# EAGLE design motorControl (EAGLE 7.5.0)

## Sheet 1 of 5: MAIN_MCU
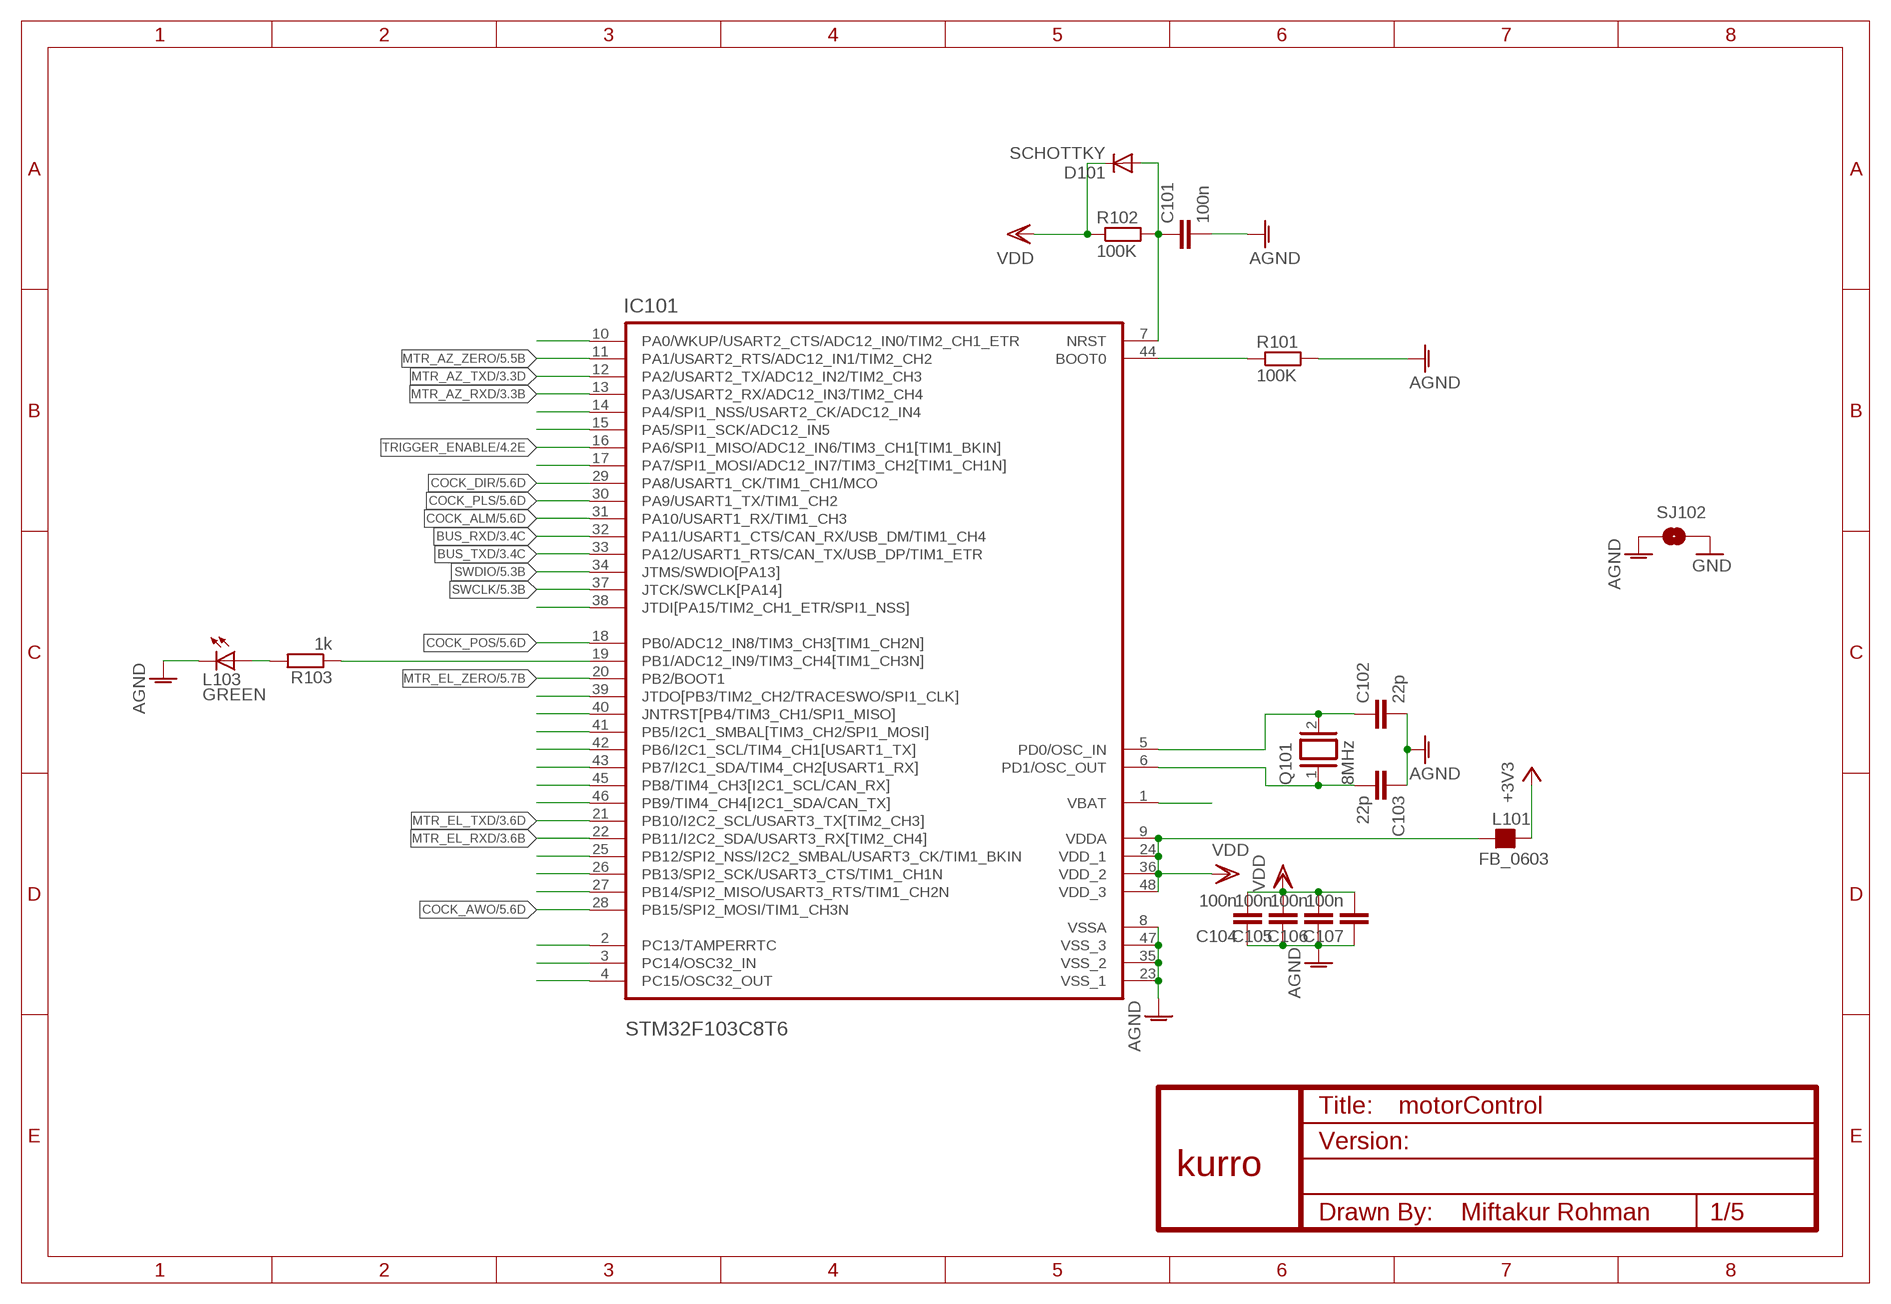
[diagram p0: schematic, sheet 1]

### Parts
C101  100n  C-EUC0603  [C0603]
C102  22p  C-EUC0603  [C0603]
C103  22p  C-EUC0603  [C0603]
C104  100n  C-EUC0603  [C0603]
C105  100n  C-EUC0603  [C0603]
C106  100n  C-EUC0603  [C0603]
C107  100n  C-EUC0603  [C0603]
D101  SCHOTTKY  DIODE-MICROMELF-W  [MICROMELF-W]
IC101  STM32F103C8T6  [QFP50P900X900X160-48N]
L101  FB_0603  [L0603]
L103  GREEN  LEDCHIP-LED0805  [CHIP-LED0805]
Q101  8MHz  XTAL/S  [QS]
R101  100K  R-EU_R0603  [R0603]
R102  100K  R-EU_R0603  [R0603]
R103  1k  R-EU_R0603  [R0603]
SJ102  SOLDERJUMPERTRACE  [SJ_2S-TRACE]
U$1  KURRO_FOOTPRINT  [KURRO-LOGO]

### Nets
+3V3: L101.2 ; also sheet 2,3,4
AGND [ic]: C101.2 C102.2 C103.1 C104.1 C105.1 C106.1 C107.1 IC101.8(VSSA) IC101.23(VSS_1) IC101.35(VSS_2) IC101.47(VSS_3) L103.C R101.2 SJ102.1
BOOT0 [ic]: IC101.44(BOOT0) R101.1
BUS_RXD [ic]: IC101.32(PA11/USART1_CTS/CAN_RX/USB_DM/TIM1_CH4) ; also sheet 3
BUS_TXD [ic]: IC101.33(PA12/USART1_RTS/CAN_TX/USB_DP/TIM1_ETR) ; also sheet 3
COCK_ALM [ic]: IC101.31(PA10/USART1_RX/TIM1_CH3) ; also sheet 5
COCK_AWO [ic]: IC101.28(PB15/SPI2_MOSI/TIM1_CH3N) ; also sheet 5
COCK_DIR [ic]: IC101.29(PA8/USART1_CK/TIM1_CH1/MCO) ; also sheet 5
COCK_PLS [ic]: IC101.30(PA9/USART1_TX/TIM1_CH2) ; also sheet 5
COCK_POS [ic]: IC101.18(PB0/ADC12_IN8/TIM3_CH3[TIM1_CH2N]) ; also sheet 5
GND: SJ102.2 ; also sheet 2,3,4,5
MTR_AZ_RXD [ic]: IC101.13(PA3/USART2_RX/ADC12_IN3/TIM2_CH4) ; also sheet 3
MTR_AZ_TXD [ic]: IC101.12(PA2/USART2_TX/ADC12_IN2/TIM2_CH3) ; also sheet 3
MTR_AZ_ZERO [ic]: IC101.11(PA1/USART2_RTS/ADC12_IN1/TIM2_CH2) ; also sheet 5
MTR_EL_RXD [ic]: IC101.22(PB11/I2C2_SDA/USART3_RX[TIM2_CH4]) ; also sheet 3
MTR_EL_TXD [ic]: IC101.21(PB10/I2C2_SCL/USART3_TX[TIM2_CH3]) ; also sheet 3
MTR_EL_ZERO [ic]: IC101.20(PB2/BOOT1) ; also sheet 5
N$1 [ic]: IC101.25(PB12/SPI2_NSS/I2C2_SMBAL/USART3_CK/TIM1_BKIN)
N$2 [ic]: L103.A R103.2
N$3 [ic]: IC101.26(PB13/SPI2_SCK/USART3_CTS/TIM1_CH1N)
N$4 [ic]: IC101.10(PA0/WKUP/USART2_CTS/ADC12_IN0/TIM2_CH1_ETR)
N$5 [ic]: IC101.19(PB1/ADC12_IN9/TIM3_CH4[TIM1_CH3N]) R103.1
N$6 [ic]: C103.2 IC101.6(PD1/OSC_OUT) Q101.1
N$7 [ic]: C102.1 IC101.5(PD0/OSC_IN) Q101.2
N$11 [ic]: IC101.3(PC14/OSC32_IN)
N$12 [ic]: IC101.2(PC13/TAMPERRTC)
N$14 [ic]: IC101.46(PB9/TIM4_CH4[I2C1_SDA/CAN_TX])
N$15 [ic]: IC101.45(PB8/TIM4_CH3[I2C1_SCL/CAN_RX])
N$16 [ic]: IC101.43(PB7/I2C1_SDA/TIM4_CH2[USART1_RX])
N$17 [ic]: IC101.39(JTDO[PB3/TIM2_CH2/TRACESWO/SPI1_CLK])
N$18 [ic]: IC101.40(JNTRST[PB4/TIM3_CH1/SPI1_MISO])
N$19 [ic]: IC101.42(PB6/I2C1_SCL/TIM4_CH1[USART1_TX])
N$20 [ic]: IC101.38(JTDI[PA15/TIM2_CH1_ETR/SPI1_NSS])
N$21 [ic]: IC101.14(PA4/SPI1_NSS/USART2_CK/ADC12_IN4)
N$23 [ic]: IC101.15(PA5/SPI1_SCK/ADC12_IN5)
N$29 [ic]: IC101.27(PB14/SPI2_MISO/USART3_RTS/TIM1_CH2N)
N$33 [ic]: IC101.17(PA7/SPI1_MOSI/ADC12_IN7/TIM3_CH2[TIM1_CH1N])
N$51 [ic]: IC101.41(PB5/I2C1_SMBAL[TIM3_CH2/SPI1_MOSI])
N$57 [ic]: IC101.4(PC15/OSC32_OUT)
N$58 [ic]: IC101.1(VBAT)
RST [ic]: C101.1 D101.A IC101.7(NRST) R102.2
SWCLK [ic]: IC101.37(JTCK/SWCLK[PA14]) ; also sheet 5
SWDIO [ic]: IC101.34(JTMS/SWDIO[PA13]) ; also sheet 5
TRIGGER_ENABLE [ic]: IC101.16(PA6/SPI1_MISO/ADC12_IN6/TIM3_CH1[TIM1_BKIN]) ; also sheet 4
VDD [ic]: C104.2 C105.2 C106.2 C107.2 D101.C IC101.9(VDDA) IC101.24(VDD_1) IC101.36(VDD_2) IC101.48(VDD_3) L101.1 R102.1 ; also sheet 5

## Sheet 2 of 5: PSU
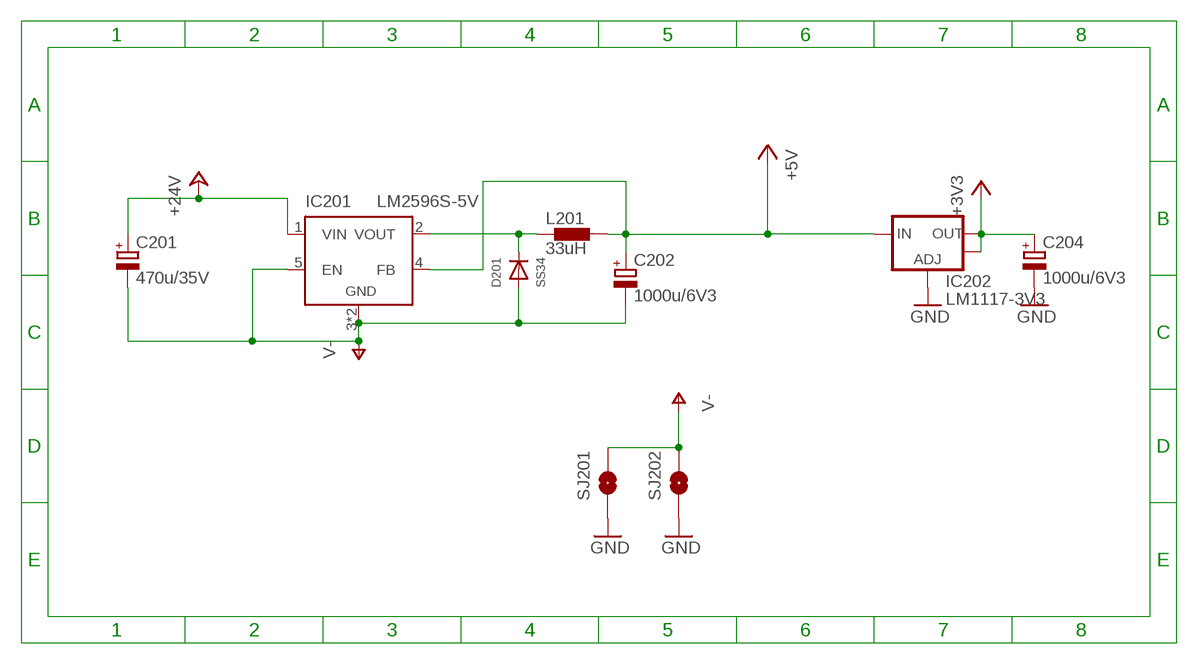
[diagram p1: schematic, sheet 2]

### Parts
C201  470u/35V  CPOL-EU153CLV-1012  [153CLV-1012]
C202  1000u/6V3  CPOL-EU153CLV-0810  [153CLV-0810]
C204  1000u/6V3  CPOL-EU153CLV-0810  [153CLV-0810]
D201  SS34  DIODESMA  [SMADIODE]
IC201  LM2596S-5V  LM2596S-ADJ  [D2PAK]
IC202  LM1117-3V3  V_REG_LM1117SOT223  [SOT223]
L201  33uH  PA4342  [PA4342]
SJ201  SOLDERJUMPERTRACE  [SJ_2S-TRACE]
SJ202  SOLDERJUMPERTRACE  [SJ_2S-TRACE]

### Nets
+3V3: C204.+ IC202.2(OUT) IC202.4(OUT) ; also sheet 1,3,4
+5V: C202.+ IC201.4(FB) IC202.3(IN) L201.P$2 ; also sheet 3,5
+24V [power]: C201.+ IC201.1(VIN) ; also sheet 4,5
GND: C204.- IC202.1(ADJ) SJ201.1 SJ202.1 ; also sheet 1,3,4,5
LM2596_OUT [power]: D201.C IC201.2(VOUT) L201.P$1
V- [power]: C201.- C202.- D201.A IC201.3(GND) IC201.5(EN) IC201.6(GND) SJ201.2 SJ202.2 ; also sheet 4,5

## Sheet 3 of 5: COMM
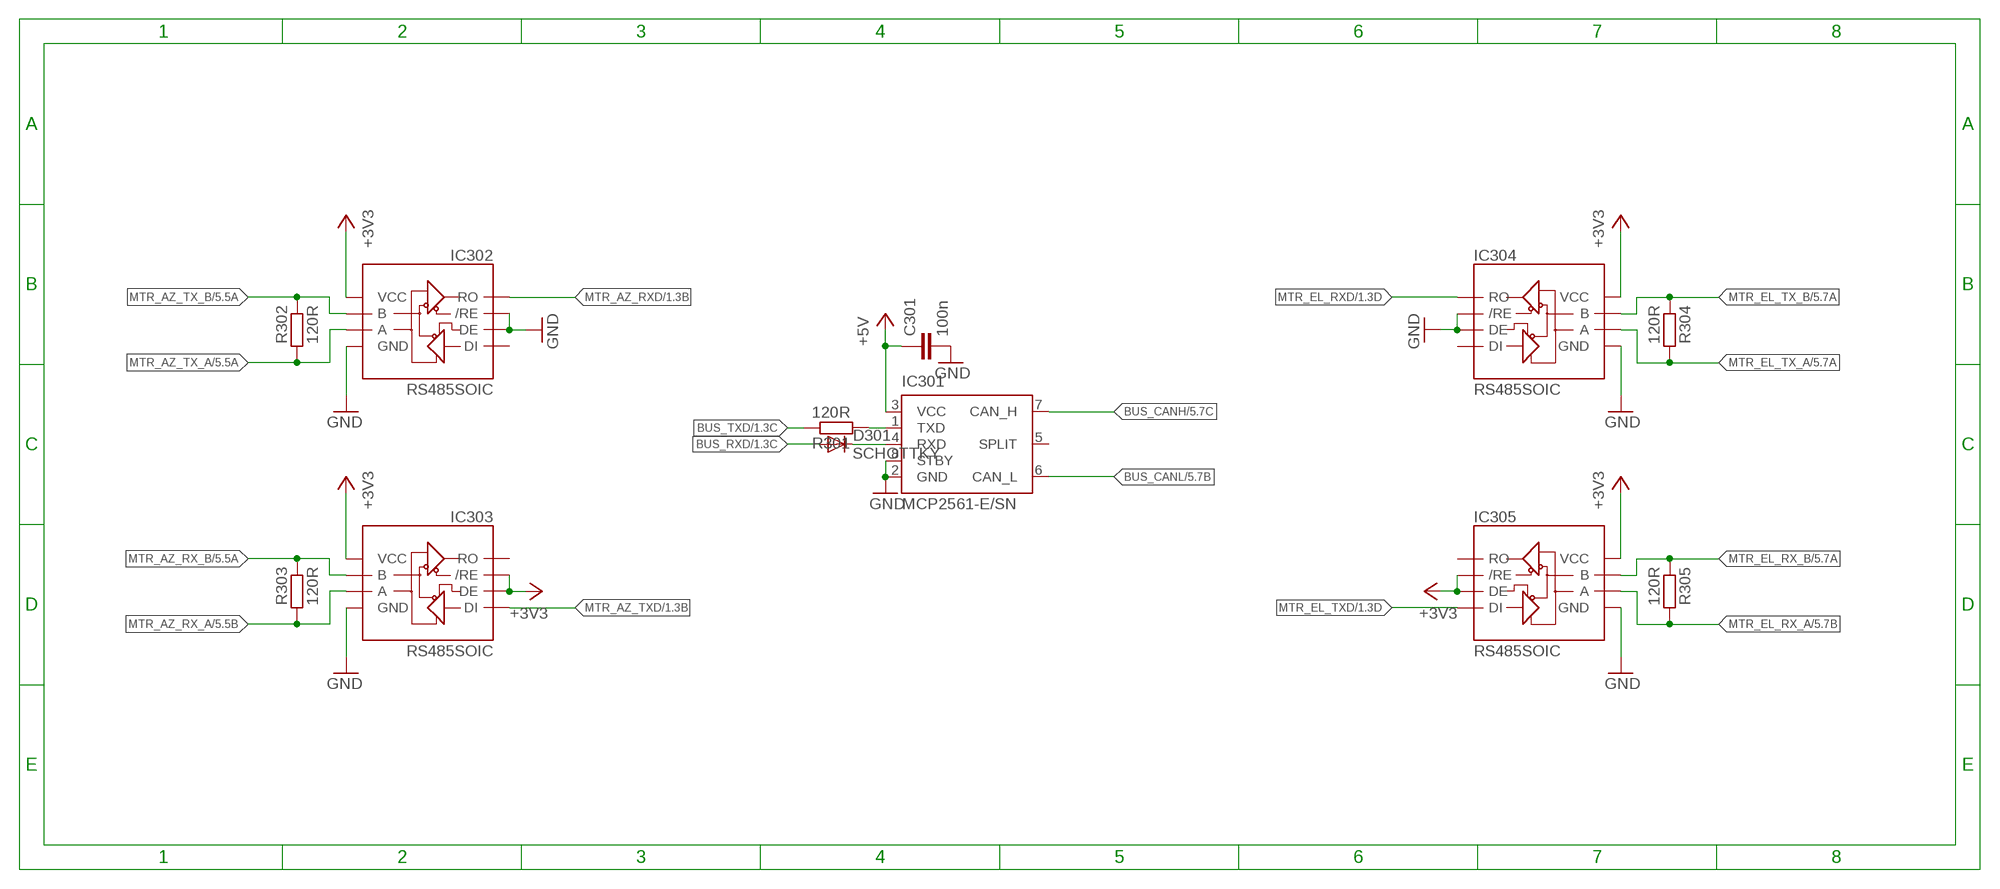
[diagram p2: schematic, sheet 3]

### Parts
C301  100n  C-EUC0603  [C0603]
D301  SCHOTTKY  DIODE-MICROMELF-W  [MICROMELF-W]
IC301  MCP2561-E/SN  [SOIC-8]
IC302  RS485SOIC  [SO08]
IC303  RS485SOIC  [SO08]
IC304  RS485SOIC  [SO08]
IC305  RS485SOIC  [SO08]
R301  120R  R-EU_R0603  [R0603]
R302  120R  R-EU_R0603  [R0603]
R303  120R  R-EU_R0603  [R0603]
R304  120R  R-EU_R0603  [R0603]
R305  120R  R-EU_R0603  [R0603]

### Nets
+3V3: IC302.8(VCC) IC303.2(/RE) IC303.3(DE) IC303.8(VCC) IC304.8(VCC) IC305.2(/RE) IC305.3(DE) IC305.8(VCC) ; also sheet 1,2,4
+5V: C301.1 IC301.3(VCC) ; also sheet 2,5
BUS_CANH: IC301.7(CAN_H) ; also sheet 5
BUS_CANL: IC301.6(CAN_L) ; also sheet 5
BUS_RXD [ic]: D301.A ; also sheet 1
BUS_TXD [ic]: R301.1 ; also sheet 1
GND: C301.2 IC301.2(GND) IC301.8(STBY) IC302.2(/RE) IC302.3(DE) IC302.5(GND) IC303.5(GND) IC304.2(/RE) IC304.3(DE) IC304.5(GND) IC305.5(GND) ; also sheet 1,2,4,5
MTR_AZ_RX_A: IC303.6(A) R303.2 ; also sheet 5
MTR_AZ_RX_B: IC303.7(B) R303.1 ; also sheet 5
MTR_AZ_RXD [ic]: IC302.1(RO) ; also sheet 1
MTR_AZ_TX_A: IC302.6(A) R302.2 ; also sheet 5
MTR_AZ_TX_B: IC302.7(B) R302.1 ; also sheet 5
MTR_AZ_TXD [ic]: IC303.4(DI) ; also sheet 1
MTR_EL_RX_A: IC305.6(A) R305.2 ; also sheet 5
MTR_EL_RX_B: IC305.7(B) R305.1 ; also sheet 5
MTR_EL_RXD [ic]: IC304.1(RO) ; also sheet 1
MTR_EL_TX_A: IC304.6(A) R304.2 ; also sheet 5
MTR_EL_TX_B: IC304.7(B) R304.1 ; also sheet 5
MTR_EL_TXD [ic]: IC305.4(DI) ; also sheet 1
N$9: IC301.1(TXD) R301.2
N$10: D301.C IC301.4(RXD)
Unconnected: IC301.5(SPLIT) IC302.4(DI) IC303.1(RO) IC304.4(DI) IC305.1(RO)

## Sheet 4 of 5: TRIGGER
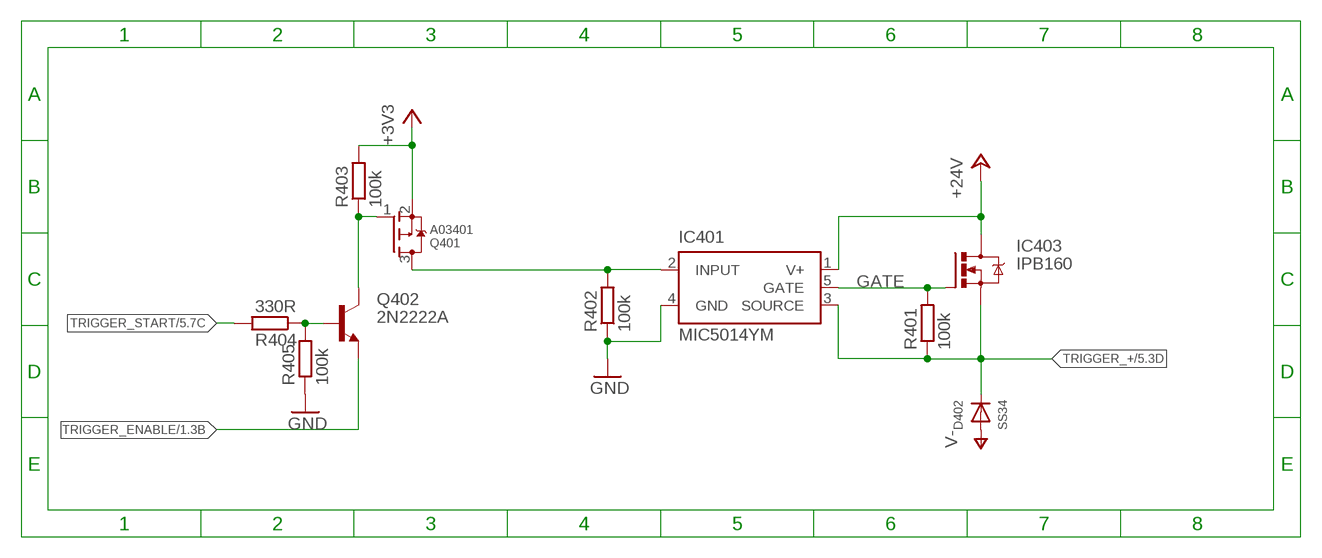
[diagram p3: schematic, sheet 4]

### Parts
D402  SS34  DIODESMA  [SMADIODE]
IC401  MIC5014YM  [SO-08]
IC403  IPB160  [PG-TO263-7]
Q401  A03401  A03401-REFLOW  [SOT23]
Q402  2N2222A  2N2222A-REFLOW  [SOT23]
R401  100k  R-EU_R0603  [R0603]
R402  100k  R-EU_R0603  [R0603]
R403  100k  R-EU_R0603  [R0603]
R404  330R  R-EU_R0603  [R0603]
R405  100k  R-EU_R0603  [R0603]

### Nets
+3V3: Q401.2(S) R403.2 ; also sheet 1,2,3
+24V [power]: IC401.1(V+) IC403.4(D) ; also sheet 2,5
GATE: IC401.5(GATE) IC403.1(G) R401.2
GND: IC401.4(GND) R402.1 R405.1 ; also sheet 1,2,3,5
N$8 [ic]: Q401.1(G) Q402.3(C) R403.1
N$32 [ic]: Q402.1(B) R404.1 R405.2
TRIGGER_+ [power]: D402.C IC401.3(SOURCE) IC403.2(S) IC403.3(S) IC403.5(S) IC403.6(S) IC403.7(S) R401.1 ; also sheet 5
TRIGGER_ENABLE [ic]: Q402.2(E) ; also sheet 1
TRIGGER_INPUT: IC401.2(INPUT) Q401.3(D) R402.2
TRIGGER_START: R404.2 ; also sheet 5
V- [power]: D402.A ; also sheet 2,5

## Sheet 5 of 5: CONNECTOR
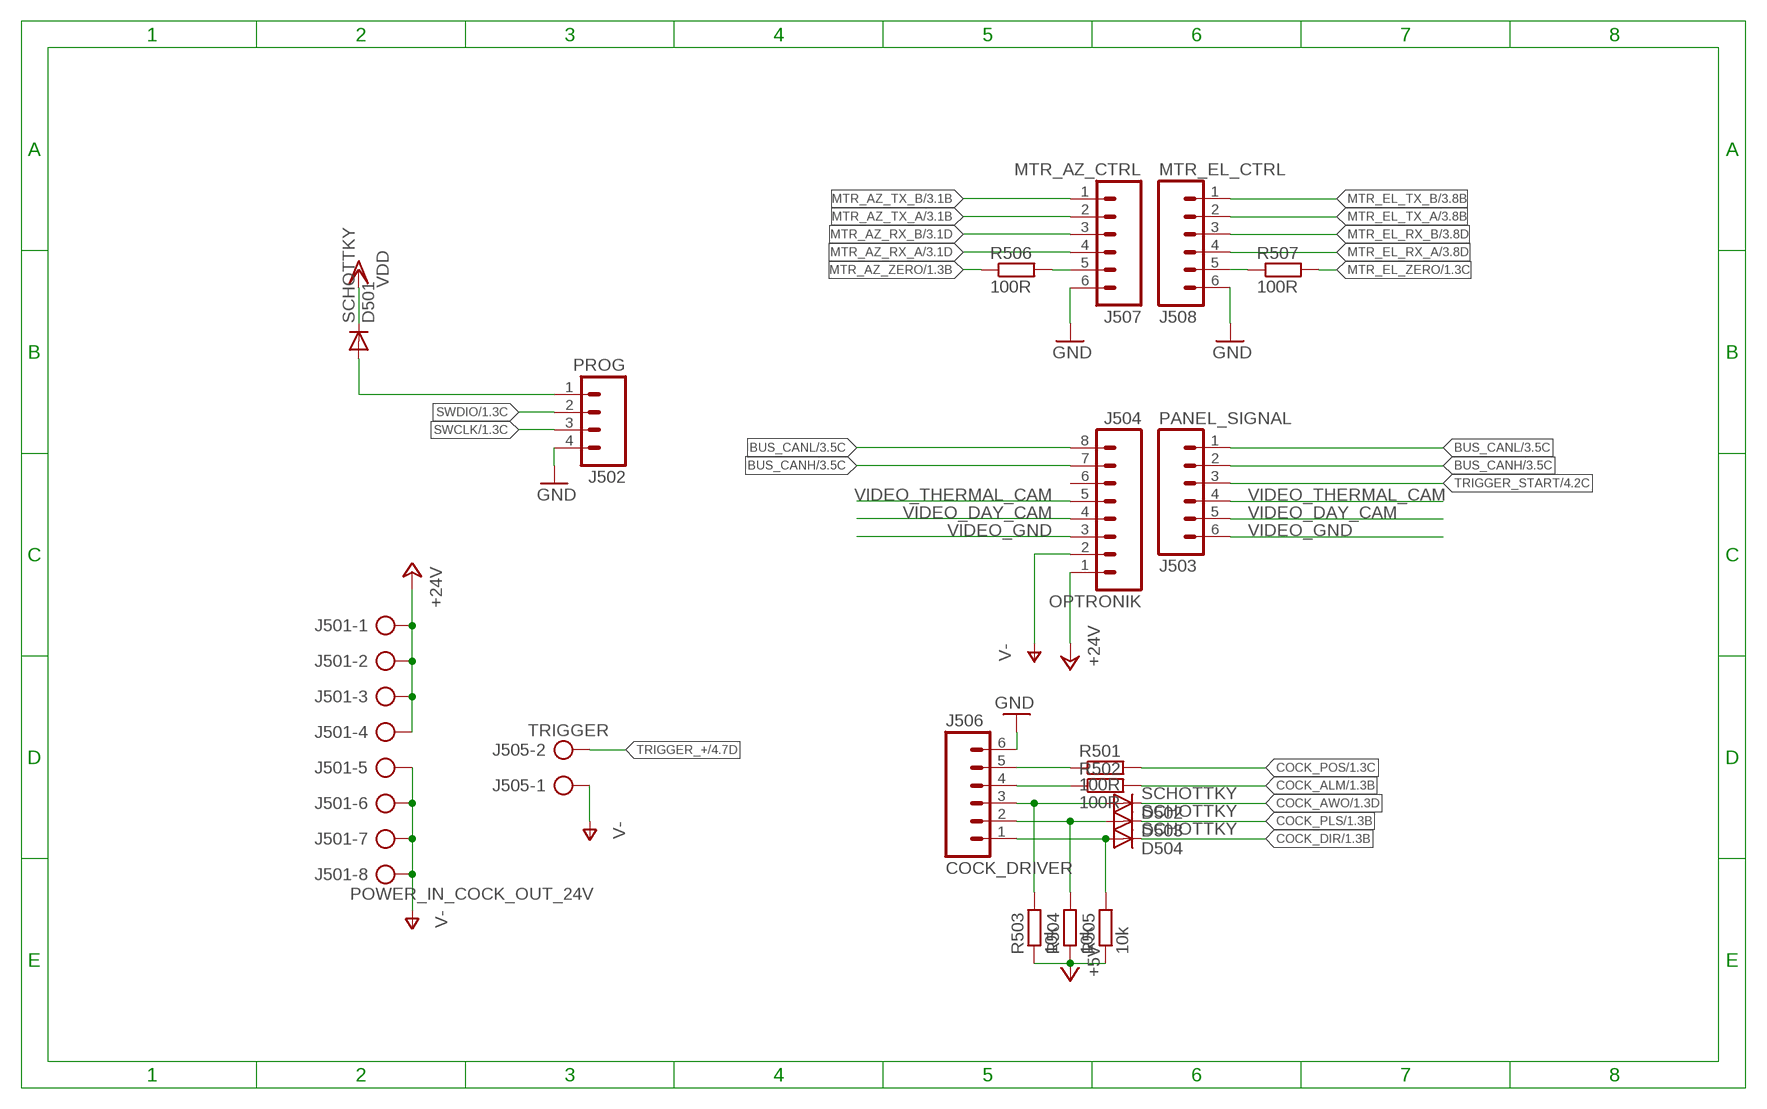
[diagram p4: schematic, sheet 5]

### Parts
D501  SCHOTTKY  DIODE-MICROMELF-W  [MICROMELF-W]
D502  SCHOTTKY  DIODE-MICROMELF-W  [MICROMELF-W]
D503  SCHOTTKY  DIODE-MICROMELF-W  [MICROMELF-W]
D504  SCHOTTKY  DIODE-MICROMELF-W  [MICROMELF-W]
J501  POWER_IN_COCK_OUT_24V  AK300/8  [AK300/8]
J502  PROG  M04-XH-VERT-SMD  [XH-4-VERT-SMD]
J503  PANEL_SIGNAL  M06-XH-VERT-SMD  [XH-6-VERT-SMD]
J504  OPTRONIK  M08-XH-VERT-SMD  [XH-8-VERT-SMD]
J505  TRIGGER  AK300/2  [AK300/2]
J506  COCK_DRIVER  M06-XH-VERT-SMD  [XH-6-VERT-SMD]
J507  MTR_AZ_CTRL  M06-XH-VERT-SMD  [XH-6-VERT-SMD]
J508  MTR_EL_CTRL  M06-XH-VERT-SMD  [XH-6-VERT-SMD]
R501  100R  R-EU_R0603  [R0603]
R502  100R  R-EU_R0603  [R0603]
R503  10k  R-EU_R0603  [R0603]
R504  10k  R-EU_R0603  [R0603]
R505  10k  R-EU_R0603  [R0603]
R506  100R  R-EU_R0603  [R0603]
R507  100R  R-EU_R0603  [R0603]

### Nets
+5V: R503.1 R504.1 R505.1 ; also sheet 2,3
+24V [power]: J501.1 J501.2 J501.3 J501.4 J504.1 ; also sheet 2,4
BUS_CANH: J503.2 J504.7 ; also sheet 3
BUS_CANL: J503.1 J504.8 ; also sheet 3
COCK_ALM [ic]: R502.2 ; also sheet 1
COCK_AWO [ic]: D502.C ; also sheet 1
COCK_DIR [ic]: D504.C ; also sheet 1
COCK_PLS [ic]: D503.C ; also sheet 1
COCK_POS [ic]: R501.2 ; also sheet 1
GND: J502.4 J506.6 J507.6 J508.6 ; also sheet 1,2,3,4
MTR_AZ_RX_A: J507.4 ; also sheet 3
MTR_AZ_RX_B: J507.3 ; also sheet 3
MTR_AZ_TX_A: J507.2 ; also sheet 3
MTR_AZ_TX_B: J507.1 ; also sheet 3
MTR_AZ_ZERO [ic]: R506.1 ; also sheet 1
MTR_EL_RX_A: J508.4 ; also sheet 3
MTR_EL_RX_B: J508.3 ; also sheet 3
MTR_EL_TX_A: J508.2 ; also sheet 3
MTR_EL_TX_B: J508.1 ; also sheet 3
MTR_EL_ZERO [ic]: R507.2 ; also sheet 1
N$13: J506.5 R501.1
N$25: D504.A J506.1 R505.2
N$26: D503.A J506.2 R504.2
N$27: D501.A J502.1
N$28: D502.A J506.3 R503.2
N$34: J508.5 R507.1
N$35: J506.4 R502.1
N$36: J507.5 R506.2
SWCLK [ic]: J502.3 ; also sheet 1
SWDIO [ic]: J502.2 ; also sheet 1
TRIGGER_+ [power]: J505.2 ; also sheet 4
TRIGGER_START: J503.3 ; also sheet 4
V- [power]: J501.5 J501.6 J501.7 J501.8 J504.2 J505.1 ; also sheet 2,4
VDD [ic]: D501.C ; also sheet 1
VIDEO_DAY_CAM: J503.5 J504.4
VIDEO_GND: J503.6 J504.3
VIDEO_THERMAL_CAM: J503.4 J504.5
Unconnected: J504.6

## Library data of the parts
C101-C107 = resistor:C-EU: CAPACITOR, European symbol
C201 C202 C204 = resistor:CPOL-EU: POLARIZED CAPACITOR, European symbol
C301 = rcl:C-EU: CAPACITOR, European symbol
D101 D301 D501-D504 = diode:DIODE-: DIODE
D201 D402 = adafruit:DIODE: Diode SMADIODE - SMA Surface Mount Package 20V 1A Schottky Diode Digikey: 641-1014-6-ND DO-1N4148 - Through Hole Small Current Diode SOD-123 20V 1 A (.5mV Vf) Schottky Diode - Digikey: MBRX120TPMSCT-ND SOD-323 10V 570mA (.38mV Vf, 3ns) Schottky Diode - Digikey: ZLLS410CT-ND SOD-523 30V 30mA Schottky Diode (RB751S-40TE61) - Digikey: RB751S-40TE61CT-ND SOT23-R/W - SOT23 Package (R = Solder Paste/Reflow Ovens, W = Hand-Soldering) BAT54Film 40V 300mA - Digikey: 497-7162-1-ND
IC101 = ST Microelctronics_By_element14_Batch_1:STM32F103C8T6: Medium-density performance line ARM-based 32-bit MCU; LINK: https://www.tokopedia.com/embedded-world/stm32-stm32f103c8t6-lqfp48-arm-based-microcontroller-mcu-lqfp-48-au02; MPN: STM32F103CBT6; OC_FARNELL: 1606327; OC_NEWARK: 11N8296; PACKAGE: QFP-48; SUPPLIER: STMICROELECTRONICS
IC201 = ON Semiconductor_By_element14_Batch_1:LM2596S: STEP-DOWN VOLTAGE REGULATOR
IC202 = SparkFun:V_REG_LM1117: Voltage Regulator LM1117 Standard adjustable voltage regulator but in SMD form. Spark Fun Electronics SKU : COM-00595
IC301 = microchip:MCP256*
IC302-IC305 = SparkFun-DigitalIC:RS485: RS485 transceiver
IC401 = microchip:MIC501*
IC403 = infineon:IPB160: IPB160 TO-263-7
J501 = con-ptr500:AK300/8: CONNECTOR; OC_FARNELL: unknown; OC_NEWARK: unknown
J502 = SparkFun-Connectors:M04: Header 4 Standard 4-pin 0.1" header. Use with straight break away headers (SKU : PRT-00116), right angle break away headers (PRT-00553), swiss pins (PRT-00743), machine pins (PRT-00117), and female headers (PRT-00115). Molex polarized connector foot print use with SKU : PRT-08231 with associated crimp pins and housings. 1MM SMD Version SKU: PRT-10208
J503 J506-J508 = SparkFun-Connectors:M06: Header 6 Standard 6-pin 0.1" header. Use with straight break away headers (SKU : PRT-00116), right angle break away headers (PRT-00553), swiss pins (PRT-00743), machine pins (PRT-00117), and female headers (PRT-00115). Molex polarized connector foot print use with SKU : PRT-08094 with associated crimp pins and housings. NOTES ON THE VARIANTS LOCK and LOCK_LONGPADS... This footprint was designed to help hold the alignment of a through-hole component (i.e. 6-pin header) while soldering it into place. You may notice that each hole has been shifted either up or down by 0.005 of an inch from it's more standard position (which is a perfectly straight line). This slight alteration caused the pins (the squares in the middle) to touch the edges of the holes. Because they are alternating, it causes a "brace" to hold the component in place. 0.005 has proven to be the perfect amount of "off-center" position when using our standard breakaway headers. Although looks a little odd when you look at the bare footprint, once you have a header in there, the alteration is very hard to notice. Also,if you push a header all the way into place, it is covered up entirely on the bottom side. This idea of altering the position of holes to aid alignment will be further integrated into the Sparkfun Library for other footprints. It can help hold any component with 3 or more connection pins.
J504 = SparkFun-Connectors:M08: Header 8 Standard 8-pin 0.1" header. Use with straight break away headers (SKU : PRT-00116), right angle break away headers (PRT-00553), swiss pins (PRT-00743), machine pins (PRT-00117), and female headers (PRT-00115).
J505 = con-ptr500:AK300/2: CONNECTOR; OC_FARNELL: unknown; OC_NEWARK: unknown
L101 = rc-master:FB_: FERRITE BEAD
L103 = led:LED: LED OSRAM: - CHIPLED LG R971, LG N971, LY N971, LG Q971, LY Q971, LO R971, LY R971 LH N974, LH R974 LS Q976, LO Q976, LY Q976 LO Q996 - Hyper CHIPLED LW Q18S LB Q993, LB Q99A, LB R99A - SideLED LS A670, LO A670, LY A670, LG A670, LP A670 LB A673, LV A673, LT A673, LW A673 LH A674 LY A675 LS A676, LA A676, LO A676, LY A676, LW A676 LS A679, LY A679, LG A679 - Hyper Micro SIDELED® LS Y876, LA Y876, LO Y876, LY Y876 LT Y87S - SmartLED LW L88C, LW L88S LB L89C, LB L89S, LG L890 LS L89K, LO L89K, LY L89K LS L896, LA L896, LO L896, LY L896 - TOPLED LS T670, LO T670, LY T670, LG T670, LP T670 LSG T670, LSP T670, LSY T670, LOP T670, LYG T670 LG T671, LOG T671, LSG T671 LB T673, LV T673, LT T673, LW T673 LH T674 LS T676, LA T676, LO T676, LY T676, LB T676, LH T676, LSB T676, LW T676 LB T67C, LV T67C, LT T67C, LS T67K, LO T67K, LY T67K, LW E67C LS E67B, LA E67B, LO E67B, LY E67B, LB E67C, LV E67C, LT E67C LW T67C LS T679, LY T679, LG T679 LS T770, LO T770, LY T770, LG T770, LP T770 LB T773, LV T773, LT T773, LW T773 LH T774 LS E675, LA E675, LY E675, LS T675 LS T776, LA T776, LO T776, LY T776, LB T776 LHGB T686 LT T68C, LB T68C - Hyper Mini TOPLED® LB M676 - Mini TOPLED Santana® LG M470 LS M47K, LO M47K, LY M47K Source: http://www.osram.convergy.de LUXEON: - LUMILED® LXK2-PW12-R00, LXK2-PW12-S00, LXK2-PW14-U00, LXK2-PW14-V00 LXK2-PM12-R00, LXK2-PM12-S00, LXK2-PM14-U00 LXK2-PE12-Q00, LXK2-PE12-R00, LXK2-PE12-S00, LXK2-PE14-T00, LXK2-PE14-U00 LXK2-PB12-K00, LXK2-PB12-L00, LXK2-PB12-M00, LXK2-PB14-N00, LXK2-PB14-P00, LXK2-PB14-Q00 LXK2-PR12-L00, LXK2-PR12-M00, LXK2-PR14-Q00, LXK2-PR14-R00 LXK2-PD12-Q00, LXK2-PD12-R00, LXK2-PD12-S00 LXK2-PH12-R00, LXK2-PH12-S00 LXK2-PL12-P00, LXK2-PL12-Q00, LXK2-PL12-R00 Source: www.luxeon.com KINGBRIGHT: KA-3528ASYC Source: www.kingbright.com
L201 = scorpion:PA4342
Q101 = special:XTAL/S: CRYSTAL
Q401 = scorpion:A03401*: 30V P-Channel MOSFET Feature: VDS: -30V ID (at VGS=10V): -4A RDS(ON) (at VGS=10V): <50mOhm RDS(ON) (at VGS = 4.5V): <60mOhm RDS(ON) (at VGS = 2.5V): <85mOhm datasheet <http://www.aosmd.com/pdfs/datasheet/AO3401.pdf> tokopedia <https://www.tokopedia.com/tokopuwei/mosfet-ao3401-fet-ao3401-sot23-p-channel-30v-4a-a19t-sot-23-az37>
Q402 = scorpion:2N2222*
R101-R103 R301-R305 R501-R507 = resistor:R-EU_: RESISTOR, European symbol
R401-R405 = rcl:R-EU_: RESISTOR, European symbol
SJ102 = SparkFun:SOLDERJUMPER: Solder Jumper Standard SMD solder jumper. Used to automate production. Two varients : Normally Open and Normally Closed are the same, but have different paste layers. NC will have a large amount of paste and should jumper during reflow.
SJ201 SJ202 = SparkFun:SOLDERJUMPER: Solder Jumper Standard SMD solder jumper. Used to automate production. Two varients : Normally Open and Normally Closed are the same, but have different paste layers. NC will have a large amount of paste and should jumper during reflow.; BOM: EXCLUDE; DNP: T
U$1 = SparkFun:KURRO_FOOTPRINT

## Net classes
0 default: width 0.406 mm, drill 0.59 mm, clearance 0.305 mm
1 ic: width 0.254 mm, drill 0.59 mm, clearance 0.203 mm
2 power: width 0.61 mm, drill 0.79 mm, clearance 0.305 mm

## Board
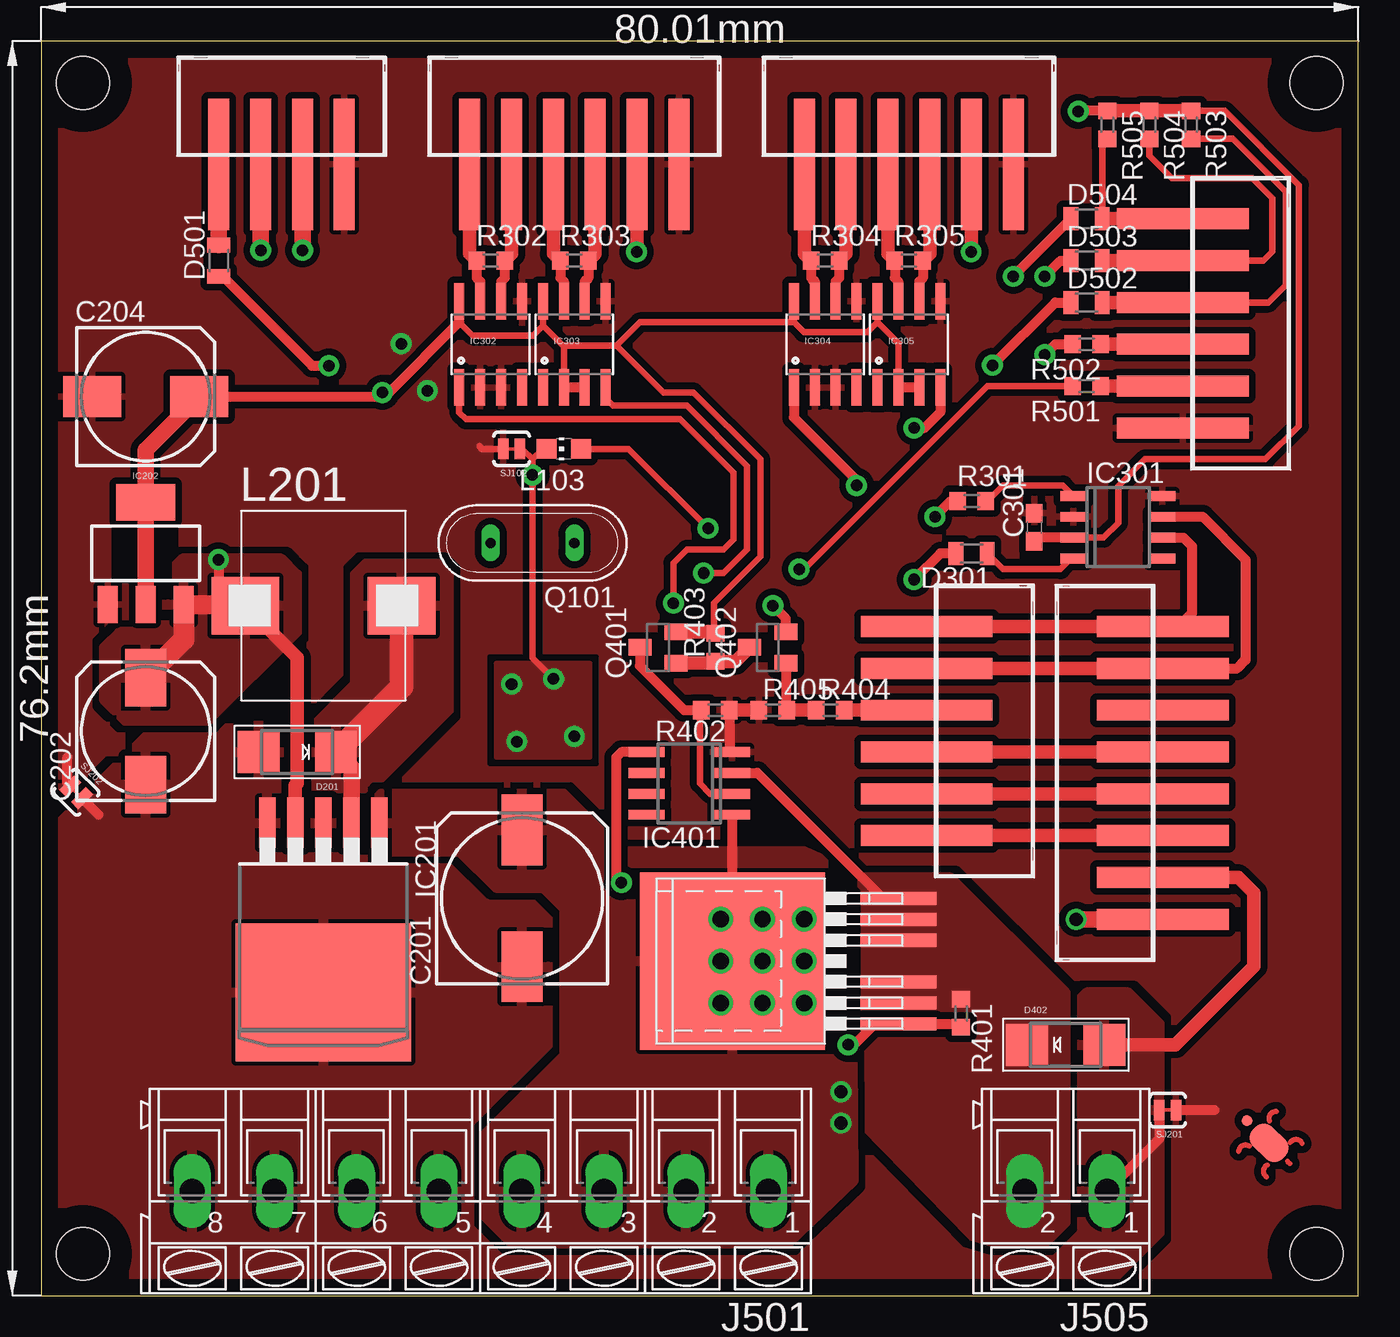
[diagram p5: board, top side]
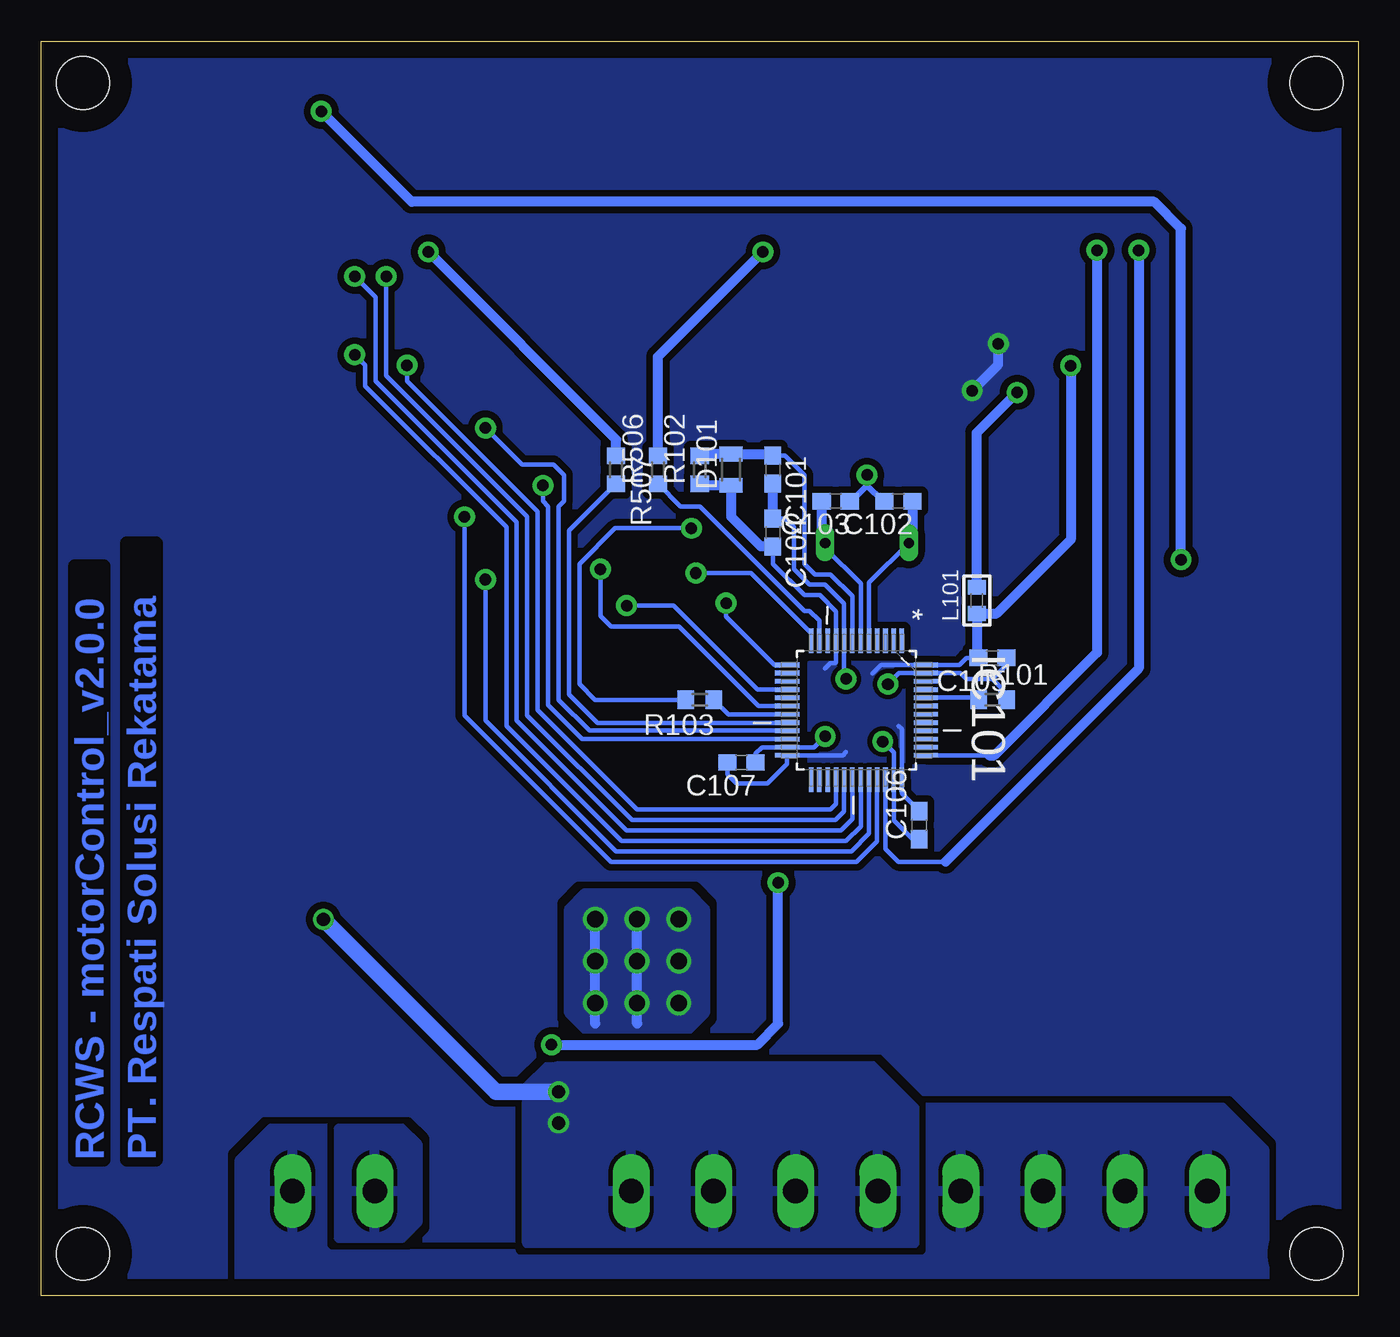
[diagram p6: board, bottom side, seen from below]

Size 80.01 x 76.2 mm. Coordinates in mm from the lower left corner, seen from the top.
Outline: 0,0 80.01,0 80.01,76.2 0,76.2 0,0
Copper layers (1*16): Top 0.035mm / dielectric 1.5mm / Bottom 0.035mm
Design rules "default": minimum track width 10mil, minimum drill 24mil, track to track 8mil, track to pad 8mil, pad to pad 8mil, via to via 8mil, smd to smd 8mil, copper to edge 40mil, drill to drill 8mil, minimum pad ring 10mil, minimum via ring 8mil, stop-mask expansion 4mil, vias tented up to drill 0mil, thermal gap 10mil
Holes 3.2 mm at 2.54,2.54 2.54,73.66 77.47,2.54 77.47,73.66
tRestrict: area 0,0 to 5.1,5.1; area 0,71.1 to 5.1,76.2; area 74.9,0 to 80,5.1; area 74.9,71.1 to 80,76.2; area 47.6,16 to 49.4,24.4; area 4.7,43.7 to 5.3,46.5; area 7.3,43.7 to 7.9,46.7
bRestrict: area 0,0 to 5.1,5.1; area 0,71.1 to 5.1,76.2; area 74.9,0 to 80,5.1; area 74.9,71.1 to 80,76.2

### Footprints (pad centres in the part's own frame; a part is rotated, then mirrored left to right if it is on the bottom)
C0603 = smd 1.1 x 1: 1 -0.85,0; 2 0.85,0
153CLV-1012 = smd 4.3 x 2.5: + 4.15,0; - -4.15,0
153CLV-0810 = smd 3.5 x 2.5: + 3.25,0; - -3.25,0
MICROMELF-W = smd 0.9 x 1.4: A 0.95,0; C -0.95,0
SMADIODE = smd 2.54 x 2.54: A 2.349,0; C -2.349,0
QFP50P900X900X160-48N = smd 1.473 x 0.279: 1 -4.216,2.743; 2 -4.216,2.261; 3 -4.216,1.753; 4 -4.216,1.245; 5 -4.216,0.762; 6 -4.216,0.254; 7 -4.216,-0.254; 8 -4.216,-0.762; 9 -4.216,-1.245; 10 -4.216,-1.753; 11 -4.216,-2.261; 12 -4.216,-2.743; 25 4.216,-2.743; 26 4.216,-2.261; 27 4.216,-1.753; 28 4.216,-1.245; 29 4.216,-0.762; 30 4.216,-0.254; 31 4.216,0.254; 32 4.216,0.762; 33 4.216,1.245; 34 4.216,1.753; 35 4.216,2.261; 36 4.216,2.743 | smd 0.279 x 1.473: 13 -2.743,-4.216; 14 -2.261,-4.216; 15 -1.753,-4.216; 16 -1.245,-4.216; 17 -0.762,-4.216; 18 -0.254,-4.216; 19 0.254,-4.216; 20 0.762,-4.216; 21 1.245,-4.216; 22 1.753,-4.216; 23 2.261,-4.216; 24 2.743,-4.216; 37 2.743,4.216; 38 2.261,4.216; 39 1.753,4.216; 40 1.245,4.216; 41 0.762,4.216; 42 0.254,4.216; 43 -0.254,4.216; 44 -0.762,4.216; 45 -1.245,4.216; 46 -1.753,4.216; 47 -2.261,4.216; 48 -2.743,4.216
D2PAK = smd 3.05 x 1.016: 1 10.305,-3.404; 2 10.305,-1.702; 3 10.305,0; 4 10.305,1.702; 5 10.305,3.404 | smd 8.38 x 10.66: 6 0,0
SOT223 = smd 1.219 x 2.235: 1 -2.311,-3.099; 2 0,-3.099; 3 2.311,-3.099 | smd 3.6 x 2.2: 4 0,3.099
SOIC-8 = smd 0.6 x 1.6: 1 -1.905,-2.7; 2 -0.635,-2.7; 3 0.635,-2.7; 4 1.905,-2.7; 5 1.905,2.7; 6 0.635,2.7; 7 -0.635,2.7; 8 -1.905,2.7
SO08 = smd 0.61 x 2.21: 1 -1.905,-2.616; 2 -0.635,-2.616; 3 0.635,-2.616; 4 1.905,-2.616; 5 1.905,2.616; 6 0.635,2.616; 7 -0.635,2.616; 8 -1.905,2.616
SO-08 = smd 0.6 x 2.2: 1 -1.905,-2.6; 2 -0.635,-2.6; 3 0.635,-2.6; 4 1.905,-2.6; 5 1.905,2.6; 6 0.635,2.6; 7 -0.635,2.6; 8 -1.905,2.6
PG-TO263-7 = smd 0.8 x 4.6: 1 -3.81,-4.45; 2 -2.54,-4.45; 3 -1.27,-4.45; 5 1.27,-4.45; 6 2.54,-4.45; 7 3.81,-4.45 | smd 10.8 x 11.25: 4 0,5.625
AK300/8 = drill 1.5 long: 1 -17.501,0; 2 -12.497,0; 3 -7.518,0; 4 -2.515,0; 5 2.515,0; 6 7.518,0; 7 12.497,0; 8 17.501,0
XH-4-VERT-SMD = smd 1.27 x 8: 1 -3.81,-0.5; 2 -1.27,-0.5; 3 1.27,-0.5; 4 3.81,-0.5
XH-6-VERT-SMD = smd 1.27 x 8: 1 -6.35,-0.5; 2 -3.81,-0.5; 3 -1.27,-0.5; 4 1.27,-0.5; 5 3.81,-0.5; 6 6.35,-0.5
XH-8-VERT-SMD = smd 1.27 x 8: 1 -8.89,-0.5; 2 -6.35,-0.5; 3 -3.81,-0.5; 4 -1.27,-0.5; 5 1.27,-0.5; 6 3.81,-0.5; 7 6.35,-0.5; 8 8.89,-0.5
AK300/2 = drill 1.5 long: 1 -2.515,0; 2 2.489,0
L0603 = smd 0.9 x 1.1: 1 -0.794,0; 2 0.794,0
CHIP-LED0805 = smd 1.2 x 1.2: A 0,-1.05; C 0,1.05
PA4342 = smd 3.5 x 4.1: P$1 0,4.75; P$2 0,-4.75
QS = drill 0.61 long: 1 -2.54,0; 2 2.54,0
SOT23 = smd 1 x 1.4: 1 -0.95,-1.1; 2 0.95,-1.1; 3 0,1.1
R0603 = smd 1 x 1.1: 1 -0.85,0; 2 0.85,0
SJ_2S-TRACE = smd 0.635 x 1.27: 1 -0.508,0; 2 0.508,0
KURRO-LOGO = smd 2.54 x 1.651 rotated 45 bottom: P$1 0,0 | smd 0.635 x 0.635 rotated 45 bottom: P$2 1.347,1.347

### Placement (x,y rotation side)
C101  35.56,50.16 270 bottom
C102  27.94,48.26 180 bottom
C103  31.75,48.26 180 bottom
C104  35.56,46.35 270 bottom
C105  22.23,38.73 180 bottom
C106  26.67,28.57 90 bottom
C107  37.47,32.38 180 bottom
C201  29.21,24.13 90 top
C202  6.35,34.29 90 top
C204  6.35,54.61 0 top
C301  60.33,46.67 90 top
D101  38.1,50.16 90 bottom
D201  15.56,33.02 180 top
D301  56.52,45.09 180 top
D402  62.23,15.24 0 top
D501  10.79,62.87 90 top
D502  63.5,60.33 0 top
D503  63.5,62.87 0 top
D504  63.5,65.41 0 top
IC101  30.48,35.56 270 bottom
IC201  17.14,18.41 90 top
IC202  6.35,45.09 0 top
IC301  65.41,46.67 270 top
IC302  27.3,57.78 0 top
IC303  32.38,57.78 0 top
IC304  47.62,57.78 0 top
IC305  52.7,57.78 0 top
IC401  39.37,31.11 90 top
IC403  47.62,20.32 90 top
J501  26.67,6.35 180 top
J502  14.61,69.22 0 top
J503  54.29,34.29 270 top
J504  67.63,31.75 90 top
J505  62.23,6.35 180 top
J506  69.85,59.05 270 top
J507  32.38,69.22 0 top
J508  52.7,69.22 0 top
L101  23.18,42.23 90 bottom
L103  31.75,51.44 90 top
L201  17.14,41.91 270 top
Q101  29.84,45.72 180 top
Q401  37.47,39.37 90 top
Q402  44.13,39.37 90 top
R101  22.23,36.2 0 bottom
R102  40.01,50.16 90 bottom
R103  40.01,36.2 180 bottom
R301  56.52,48.26 0 top
R302  27.3,62.87 0 top
R303  32.38,62.87 0 top
R304  47.62,62.87 0 top
R305  52.7,62.87 0 top
R401  55.88,17.14 270 top
R402  40.96,35.56 180 top
R403  40.96,39.37 90 top
R404  47.94,35.56 0 top
R405  44.45,35.56 0 top
R501  63.5,55.24 180 top
R502  63.5,57.78 180 top
R503  69.85,71.12 270 top
R504  67.31,71.12 270 top
R505  64.77,71.12 270 top
R506  42.55,50.16 90 bottom
R507  45.09,50.16 270 bottom
SJ102  28.57,51.44 180 top
SJ201  68.42,11.27 180 top
SJ202  2.13,30.57 315 top
U$1  74.59,9.28 0 bottom

### Tracks (layer width: path | path; a pad name or v marks a point on that pad's centre or on a via)
+3V3  (via drill 0.7 pad 1.27)
  Top 0.406: IC302.8 25.4,59.13 26.21,58.32 29.87,58.32 30.48,58.93 | 30.48,58.93 IC303.8 | IC303.2 31.75,57.66 | 31.75,57.66 30.48,58.93 | IC304.8 45.72,59.13 | 45.72,59.13 46.33,58.52 50.19,58.52 50.8,59.13 | 50.8,59.13 IC305.8 | IC305.2 52.07,57.86 50.8,59.13 | 45.72,59.13 36.37,59.13 34.95,57.71 | 34.95,57.71 31.8,57.71 31.75,57.66 | 40.86,40.32 40.86,42.08 43.69,44.91 43.69,50.8 39.62,54.86 37.8,54.86 34.95,57.71
  Top 0.61: IC305.3 IC305.2 | IC303.3 IC303.2 | C204.+ 20.47,54.61 v20.73,54.86 21.13,54.86 25.4,59.13
  Top 0.813: R403.2 40.86,40.32 Q401.2
  Top 1.016: IC202.2 IC202.4 6.35,51.36 C204.+
  Bottom 0.61: L101.2 23.18,52.41 v20.73,54.86
+5V  (via drill 0.7 pad 1.27)
  Top 0.406: IC301.3 64.53,46.04 65.43,46.94 65.43,49.17 67.06,50.8 74.37,50.8 76.4,52.83 76.4,67.46 71.9,71.97 R503.1
  Top 0.61: IC301.3 60.54,46.04 C301.1 | R505.1 63.03,71.97 v62.99,71.93 | v10.77,44.7 10.77,43.53 L201.P$2
  Top 0.813: L201.P$2 15.56,38.75 15.56,31.11 15.44,31 IC201.4 | R505.1 R504.1 R503.1
  Top 1.143: IC202.3 12.32,41.99 L201.P$2
  Top 1.27: IC202.3 8.66,39.85 C202.+
  Bottom 0.61: v10.77,44.7 10.77,64.82 12.39,66.45 57.51,66.45 v62.99,71.93
  pour Top (rank 2): 5.08,34.92 10.16,34.92 15.56,40.32 15.56,43.81 14.61,44.77 8.57,44.77 7.62,43.81 7.62,40.96 6.99,40.32 4.76,40.32 3.81,39.37 3.81,36.2
+24V  (via drill 0.8 pad 1.27, 1 pad 1.27)
  Top 0.61: IC401.1 41.97,20.35 IC403.4 v46.35,20.32 v46.35,17.78 | 39.46,20.32 v43.81,20.32 v43.81,17.78
  Top 1.016: J504.1 v62.87,22.86
  Bottom 0.61: 46.35,16.51 v46.35,17.78 v46.35,20.32 v46.35,22.86 | 43.81,16.51 v43.81,17.78 v43.81,20.32 v43.81,22.86
  Bottom 1.016: v48.58,12.38 52.39,12.38 v62.87,22.86
  other vias: 41.27,22.86 41.27,20.32 41.27,17.78 48.58,10.48
  pour Top (isolate 0.406): 28.57,3.17 45.4,3.17 49.37,6.99 49.21,25.72 46.35,26.99 35.24,26.99 31.75,30.48 20.64,30.48 20.32,30.16 20.32,26.99 25.4,26.99 27.62,24.77 30.48,24.77 31.75,23.5 31.75,14.61 26.99,9.84 26.99,4.76
  pour Bottom (isolate 0.406): 26.99,3.17 50.48,3.17 50.48,12.7 49.21,13.97 29.53,13.97 26.99,11.43
  pour Bottom: 39.69,17.14 40.64,16.19 46.99,16.19 47.94,17.14 47.94,23.5 46.99,24.45 40.64,24.45 39.69,23.5
AGND  (via drill 0.7 pad 1.27)
  Top 0.406: SJ102.1 29.21,51.44 29.84,50.8 | 29.84,50.8 v29.84,49.85 29.84,38.73 v31.11,37.47 | L103.C 30.48,51.44 29.84,50.8
  Bottom 0.279: C106.1 27.09,27.73 28.22,28.85 IC101.35 28.22,32.98 v28.89,33.66 | 22.23,37.47 23.81,37.47 24.17,37.82 IC101.47 27.9,37.82 v28.57,37.15 | 22.23,37.47 21.59,36.83 21.59,36.41 R101.2 | C105.1 21.38,38.31 22.23,37.47 | C107.1 36.62,32.92 36.23,33.3 IC101.23 33.06,33.3 v32.38,33.97 | v31.11,37.47 31.24,37.59 IC101.8 31.24,42.04 32.38,43.18 33.34,43.18 34.29,44.13 34.29,46.67 34.82,47.2 C104.1
  Bottom 0.406: C102.2 28.89,48.26 29.84,49.21 | 29.84,49.21 v29.84,49.85 | C103.1 30.8,48.26 29.84,49.21
  Bottom 0.61: C104.1 C101.2
  pour Top (isolate 0.406, rank 5): 27.62,32.7 33.34,32.7 33.34,38.42 27.62,38.42
BOOT0
  Bottom 0.279: IC101.44 23.2,36.32 R101.1
BUS_CANH
  Top 0.61: IC301.7 70.55,47.31 73.15,44.7 73.15,38.61 72.64,38.1 J504.7
  Top 0.813: J503.2 J504.7
BUS_CANL
  Top 0.61: IC301.6 69.38,46.04 69.9,45.52 69.9,41.45 69.09,40.64 J504.8
  Top 0.813: J503.1 J504.8
BUS_RXD  (via drill 0.7 pad 1.27)
  Top 0.61: D301.A 54.61,45.09 v53.02,43.5
  Bottom 0.279: IC101.32 29.72,28.07 30.8,26.99 45.09,26.99 53.02,34.92 v53.02,43.5
BUS_TXD  (via drill 0.7 pad 1.27)
  Top 0.61: R301.1 55.24,48.26 v54.29,47.31
  Bottom 0.279: IC101.33 29.23,27.6 30.48,26.35 45.4,26.35 54.29,35.24 v54.29,47.31
COCK_ALM  (via drill 0.7 pad 1.27)
  Top 0.61: v60.96,57.15 61.59,57.78 R502.2
  Bottom 0.279: IC101.31 30.23,28.51 31.11,27.62 44.77,27.62 51.75,34.61 51.75,46.67 60.33,55.24 60.33,56.52 v60.96,57.15
COCK_AWO  (via drill 0.7 pad 1.27)
  Top 0.61: v57.78,56.52 61.59,60.33 D502.C
  Bottom 0.279: IC101.28 31.73,29.87 32.07,29.53 43.81,29.53 49.85,35.56 49.85,47.62 57.78,55.56 v57.78,56.52
COCK_DIR  (via drill 0.7 pad 1.27)
  Top 0.61: D504.C v59.06,61.91 v59.05,61.91
  Bottom 0.279: IC101.29 31.24,29.4 31.75,28.89 44.13,28.89 50.48,35.24 50.48,47.31 59.05,55.88 v59.05,61.91
COCK_PLS  (via drill 0.7 pad 1.27)
  Top 0.61: v60.96,61.91 61.91,62.87 D503.C
  Bottom 0.279: IC101.30 30.73,28.96 31.43,28.26 44.45,28.26 51.12,34.92 51.12,46.99 59.69,55.56 59.69,60.64 v60.96,61.91
COCK_POS  (via drill 0.7 pad 1.27)
  Top 0.406: R501.2 57.47,55.24 46.35,44.13 v46.04,44.13
  Bottom 0.279: IC101.18 36.45,35.81 41.27,40.64 45.4,40.64 46.04,41.27 v46.04,44.13
GATE  (via drill 0.7 pad 1.27)
  Top 0.61: R401.2 55.66,16.51 IC403.1 50.65,16.51 49.38,15.24 v49.01,15.24 | IC401.5 35.24,33.02 34.92,32.7 34.92,25.4 v35.24,25.08
  Bottom 0.61: v49.01,15.24 36.51,15.24 35.24,16.51 v35.24,25.08
GND  (via drill 0.7 pad 1.27)
  Top 0.406: SJ102.2 26.8,51.44 26.62,51.61
  Top 0.61: R402.1 41.81,33.18 IC401.4 | SJ201.1 71.28,11.27 | SJ202.1 1.59,31.11 1.59,32.7
  Top 0.813: R405.1 R402.1
  Bottom 0.61: v23.46,54.97 21.87,56.55 v21.87,57.82
  pour Top (isolate 0.406, rank 6): 0,0 80.01,0 80.01,76.2 0,76.2
  pour Bottom (isolate 0.406, rank 6): 0,0 80.01,0 80.01,76.2 0,76.2
LM2596_OUT
  Top 1.016: IC201.2 18.85,32.08 D201.C
  Top 1.422: L201.P$1 21.89,37.01 D201.C
  pour Top (isolate 0.406, rank 2): 16.51,30.8 20,30.8 24.13,34.92 24.77,35.56 24.77,43.81 24.13,44.45 19.68,44.45 19.05,43.81 19.05,37.15 16.51,34.61
MTR_AZ_RX_A
  Top 0.61: R303.2 33.23,61.81 33.02,61.59 IC303.6
  Top 0.813: J507.4 33.66,63.28 R303.2
MTR_AZ_RX_B
  Top 0.61: R303.1 31.54,61.81 31.75,61.59 IC303.7
  Top 0.813: J507.3 31.11,63.28 R303.1
MTR_AZ_RXD  (via drill 0.7 pad 1.27)
  Top 0.406: IC302.1 25.4,53.65 25.81,53.24 38.81,53.24 42.06,49.99 42.06,45.92 41.45,45.31 39.22,45.31 38.41,44.5 v38.41,42.06
  Bottom 0.279: IC101.13 35.46,38.3 38.41,41.25 v38.41,42.06
MTR_AZ_TX_A
  Top 0.61: R302.2 28.16,61.81 27.94,61.59 IC302.6
  Top 0.813: J507.2 28.57,63.28 R302.2
MTR_AZ_TX_B
  Top 0.61: R302.1 26.45,61.81 26.67,61.59 IC302.7
  Top 0.813: J507.1 26.04,63.28 R302.1
MTR_AZ_TXD  (via drill 0.7 pad 1.27)
  Top 0.406: IC303.4 34.29,54.51 34.75,54.05 39.22,54.05 42.88,50.39 42.88,45.31 41.45,43.89 v40.23,43.89
  Bottom 0.279: IC101.12 33.22,40.21 36.91,43.89 v40.23,43.89
MTR_AZ_ZERO
  Bottom 0.279: R506.1 41.17,47.94 40.01,47.94 33.66,41.59 33.34,41.59 32.74,41 IC101.11
MTR_EL_RX_A
  Top 0.61: R305.2 53.55,61.81 53.34,61.59 IC305.6
  Top 0.813: J508.4 53.98,63.28 R305.2
MTR_EL_RX_B
  Top 0.61: R305.1 51.85,61.81 52.07,61.59 IC305.7
  Top 0.813: J508.3 51.44,63.28 R305.1
MTR_EL_RXD  (via drill 0.7 pad 1.27)
  Top 0.61: IC304.1 45.72,53.34 49.53,49.53 v49.53,49.21
  Bottom 0.279: IC101.22 47.14,33.81 49.21,35.88 49.21,47.94 49.53,48.26 v49.53,49.21
MTR_EL_TX_A
  Top 0.61: R304.2 48.48,61.81 48.26,61.59 IC304.6
  Top 0.813: J508.2 48.9,63.28 R304.2
MTR_EL_TX_B
  Top 0.61: R304.1 46.77,61.81 46.99,61.59 IC304.7
  Top 0.813: J508.1 46.35,63.28 R304.1
MTR_EL_TXD  (via drill 0.7 pad 1.27)
  Top 0.61: IC305.4 54.61,53.66 53.66,52.7 v53.02,52.7
  Bottom 0.279: IC101.21 46.7,34.31 48.58,36.2 48.58,47.94 48.26,48.26 48.26,49.85 48.9,50.48 50.8,50.48 v53.02,52.7
MTR_EL_ZERO
  Bottom 0.279: IC101.20 46.23,34.8 47.94,36.51 47.94,46.46 R507.2
N$2  (via drill 0.7 pad 1.27)
  Top 0.406: L103.A 35.69,51.44 v40.51,46.61
  Bottom 0.279: R103.2 46.35,36.2 47.31,37.15 47.31,44.45 45.15,46.61 v40.51,46.61
N$5
  Bottom 0.279: IC101.19 38.27,35.31 R103.1
N$6
  Bottom 0.279: IC101.6 30.23,43.24 32.38,45.4 Q101.1
  Bottom 0.61: C103.2 32.6,45.94 Q101.1
N$7
  Bottom 0.279: IC101.5 29.72,43.31 Q101.2
  Bottom 0.61: C102.1 27.09,45.94 Q101.2
N$8
  Top 0.813: Q401.1 40.86,38.42 R403.1 42.18,38.52 Q402.3
N$9
  Top 0.406: R301.2 57.47,48.26 58.42,49.21 62.07,49.21 IC301.1
N$10
  Top 0.406: IC301.4 62.55,44.77 61.91,44.13 58.42,44.13 D301.C
N$13
  Top 0.813: R501.1 J506.5
N$25
  Top 0.406: D504.A 64.45,69.95 R505.2
  Top 0.813: J506.1 D504.A
N$26
  Top 0.406: J506.2 74.24,62.87 74.78,63.4 74.78,66.65 73.56,67.87 68.68,67.87 67.31,69.24 R504.2
  Top 0.813: D503.A J506.2
N$27
  Top 1.016: J502.1 D501.A
N$28
  Top 0.406: J506.3 74.55,60.33 75.59,61.37 75.59,67.06 72.38,70.27 R503.2
  Top 0.813: D502.A J506.3
N$32
  Top 0.61: Q402.1 45.23,35.63 R405.2
  Top 0.813: R405.2 R404.1
N$34  (via drill 0.7 pad 1.27)
  Top 0.813: J508.5 56.52,63.42 v56.49,63.4
  Bottom 0.61: R507.1 45.09,51.99 v56.49,63.4
N$35
  Top 0.813: R502.1 J506.4
N$36  (via drill 0.7 pad 1.27)
  Top 0.813: J507.5 36.2,63.42 v36.17,63.4
  Bottom 0.61: R506.2 42.55,57.02 v36.17,63.4
RST
  Bottom 0.279: IC101.7 30.73,42.48 32.07,43.81 33.02,43.81 33.66,44.45 33.66,49.85 34.82,51.02 C101.1
  Bottom 0.61: C101.1 35.66,51.12 D101.A 39.91,51.12 R102.2
SWCLK  (via drill 0.7 pad 1.27)
  Top 1.016: J502.3 v15.88,63.5
  Bottom 0.279: IC101.37 22.43,32.82
  Bottom 0.61: 22.43,32.82 22.11,32.82 15.88,39.05 v15.88,63.5
SWDIO  (via drill 0.7 pad 1.27)
  Top 1.016: J502.2 v13.34,63.5
  Bottom 0.279: IC101.34 28.73,27.14 27.94,26.35 25.08,26.35
  Bottom 0.61: 25.08,26.35 13.34,38.1 v13.34,63.5
TRIGGER_+
  Top 0.61: IC401.3 43.5,31.75 51.12,24.13 IC403.7
  pour Top (isolate 0.406, rank 2, no thermals): 56.52,3.65 58.1,3.17 60.96,3.17 62.23,4.45 62.23,18.41 55.24,25.4 49.85,25.4 50.01,10.32
  pour Bottom (isolate 0.406, rank 2): 58.1,3.49 61.91,3.49 61.91,10.16 58.1,10.16 57.15,9.21 57.15,4.45
TRIGGER_ENABLE  (via drill 0.7 pad 1.27)
  Top 0.61: Q402.2 45.23,41.13 v44.45,41.91
  Bottom 0.279: IC101.16 36.49,36.8 41.59,41.91 v44.45,41.91
TRIGGER_INPUT
  Top 0.406: IC401.2 40.64,30.48 40.01,31.11 40.01,35.46 R402.2
  Top 0.61: Q401.3 36.37,38.25 39.05,35.56 R402.2
TRIGGER_START
  Top 0.813: J503.3 R404.2
V-
  Top 0.61: SJ201.2 67.91,9.52 J505.1 | SJ202.2 3.49,29.21
  Top 0.813: J504.2 72.71,25.4 73.66,24.45 73.66,20 68.9,15.24 D402.A
  pour Top (isolate 0.406, rank 5): 17.78,28.57 17.78,31.75 14.61,34.61
  pour Top (isolate 0.406, rank 5): 0,0 64.14,0 67.94,3.81 67.94,16.51 66.04,18.41 63.5,18.41 62.23,17.14 62.23,4.13 60.96,2.86 56.52,2.86 49.85,9.53 49.85,6.51 46.2,2.86 28.89,2.86 26.67,5.08 26.67,9.84 31.43,14.61 31.43,22.86 27.94,26.35 21.27,26.35 17.78,28.26 17.78,31.43 14.61,34.61 6.99,34.61 0,27.62
  pour Bottom (isolate 0.406, rank 5): 5.71,0 67.94,0 67.94,8.26 66.04,10.16 62.55,10.16 62.55,2.54 26.67,2.54 26.67,11.43 8.26,11.43 5.71,8.89
VDD  (via drill 0.7 pad 1.27)
  Top 0.61: D501.C 11.03,61.91 16.46,56.49 v17.48,56.49
  Bottom 0.279: C106.2 27.74,30.49 IC101.36 27.74,34.4 27.94,34.61 | C105.2 23.81,38.73 24.24,38.3 IC101.48 29.01,38.3 29.53,37.78 | C107.2 38.31,31.65 37.78,31.11 35.88,31.11 34.7,32.3 IC101.24 31.32,32.82 31.11,33.02 | 32.38,38.1 32.07,38.42 31.75,38.42 31.73,38.44 IC101.9 31.73,41.57 32.7,42.55 33.66,42.55 35.56,44.45 C104.2
  Bottom 0.61: R102.1 39.91,49.22 D101.C 38.1,47.31 36.3,45.51 C104.2 | C105.2 23.18,38.84 L101.1 21.96,41.43 17.48,45.92 v17.48,56.49
  pour Bottom (isolate 0.279): 27.62,32.38 33.34,32.38 33.34,38.42 27.62,38.42
VIDEO_DAY_CAM
  Top 0.813: J503.5 J504.4
VIDEO_GND
  Top 0.813: J503.6 J504.3
VIDEO_THERMAL_CAM
  Top 0.813: J503.4 J504.5

### Text on the board
Bottom: PT. Respati Solusi Rekatama | RCWS - motorControl_v2.0.0